# Altium schematic sheet 1_P1.schdoc
size 429 x 307 mm; Symbol: Drawing-Symbol_A4; Device: Drawing-Symbol_A4; Company: 嘉立创EDA; Drawed: Ideal_Fox; Version: V3.0; Page Size: A3; @Project Name: Type_C硬盘盒_2025-09-27_14-32-02; @Page Count: 1; @Update Date: 2025-12-05; @Create Date: 2025-09-27; @Schematic Name: Schematic1; @Page No: 1; @Page Name: P1; @Create Time: 06:32:47; @Update Time: 22:13:30; Width: 1655; Height: 1170; Region Start: 1; X Region Count: 6; Y Region Count: 4; Blade Width: 10; Title Block Position: 3; @Board Name: Board1
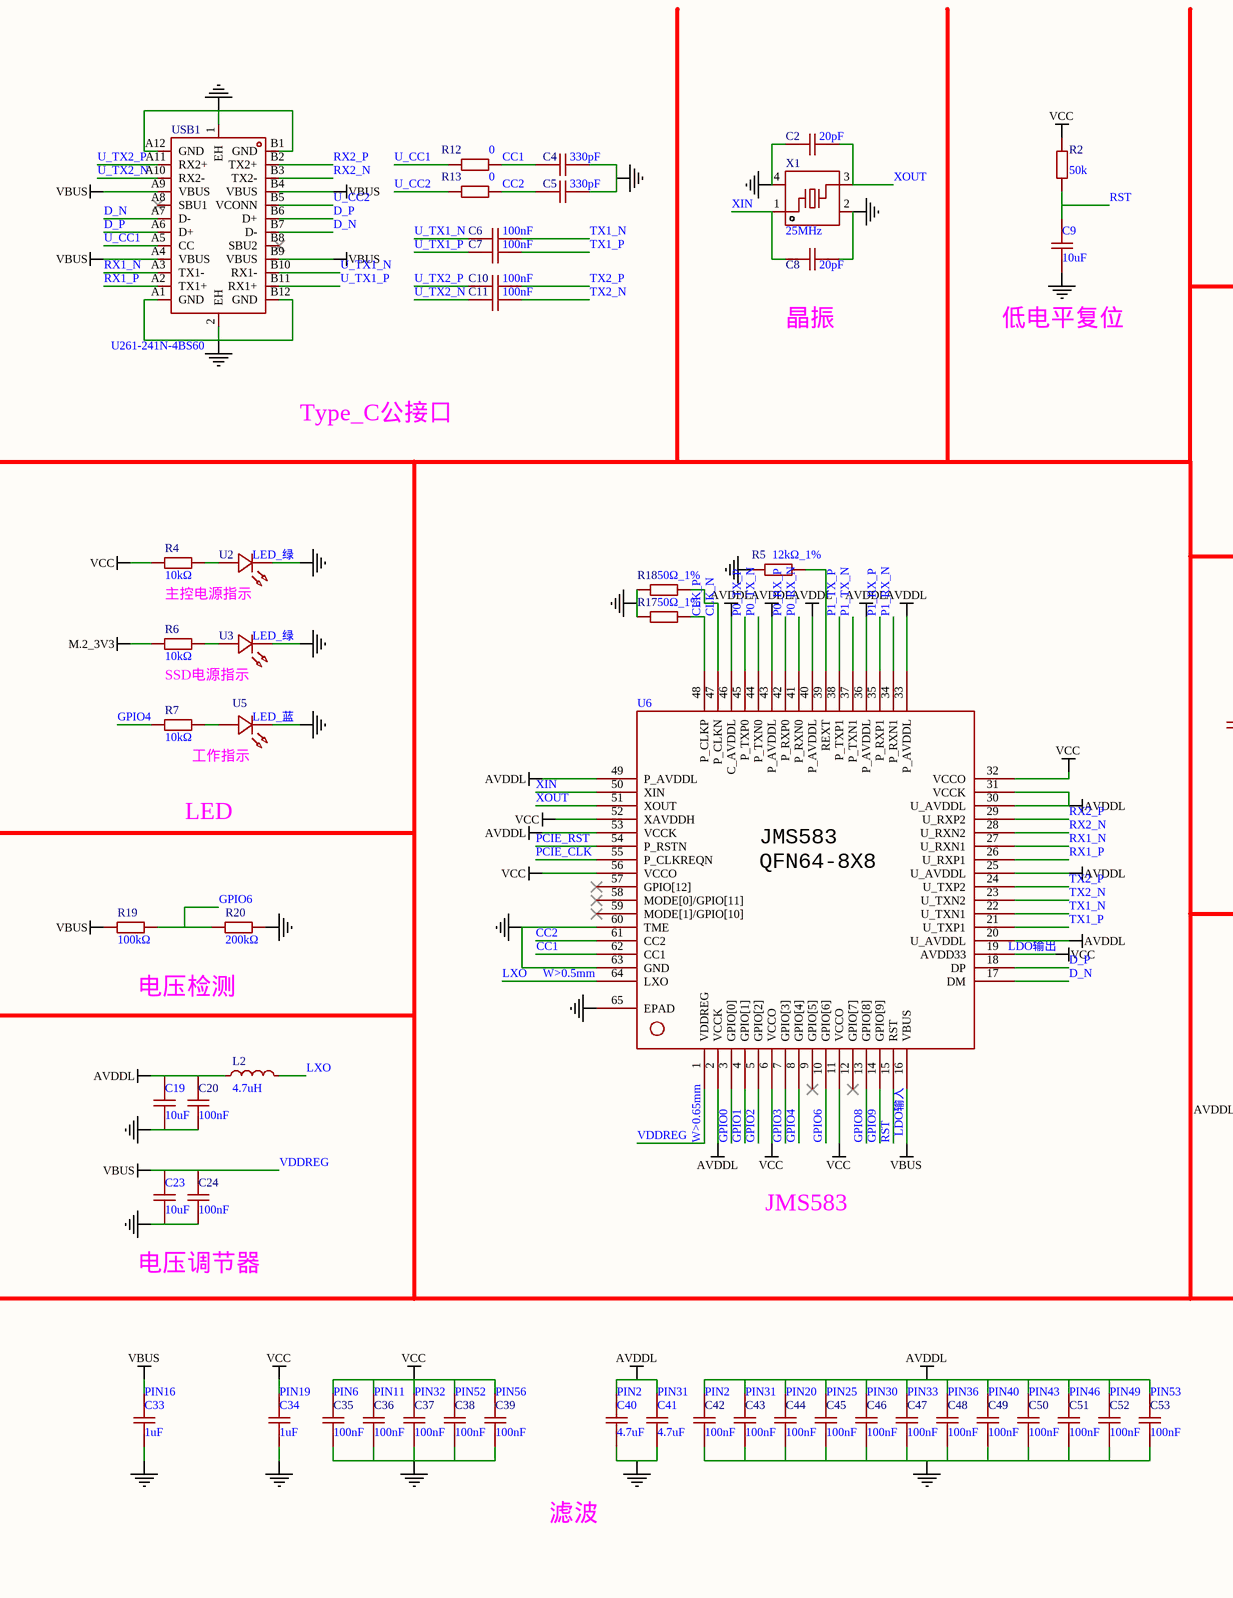
[diagram p0: 1_P1.schdoc, left]
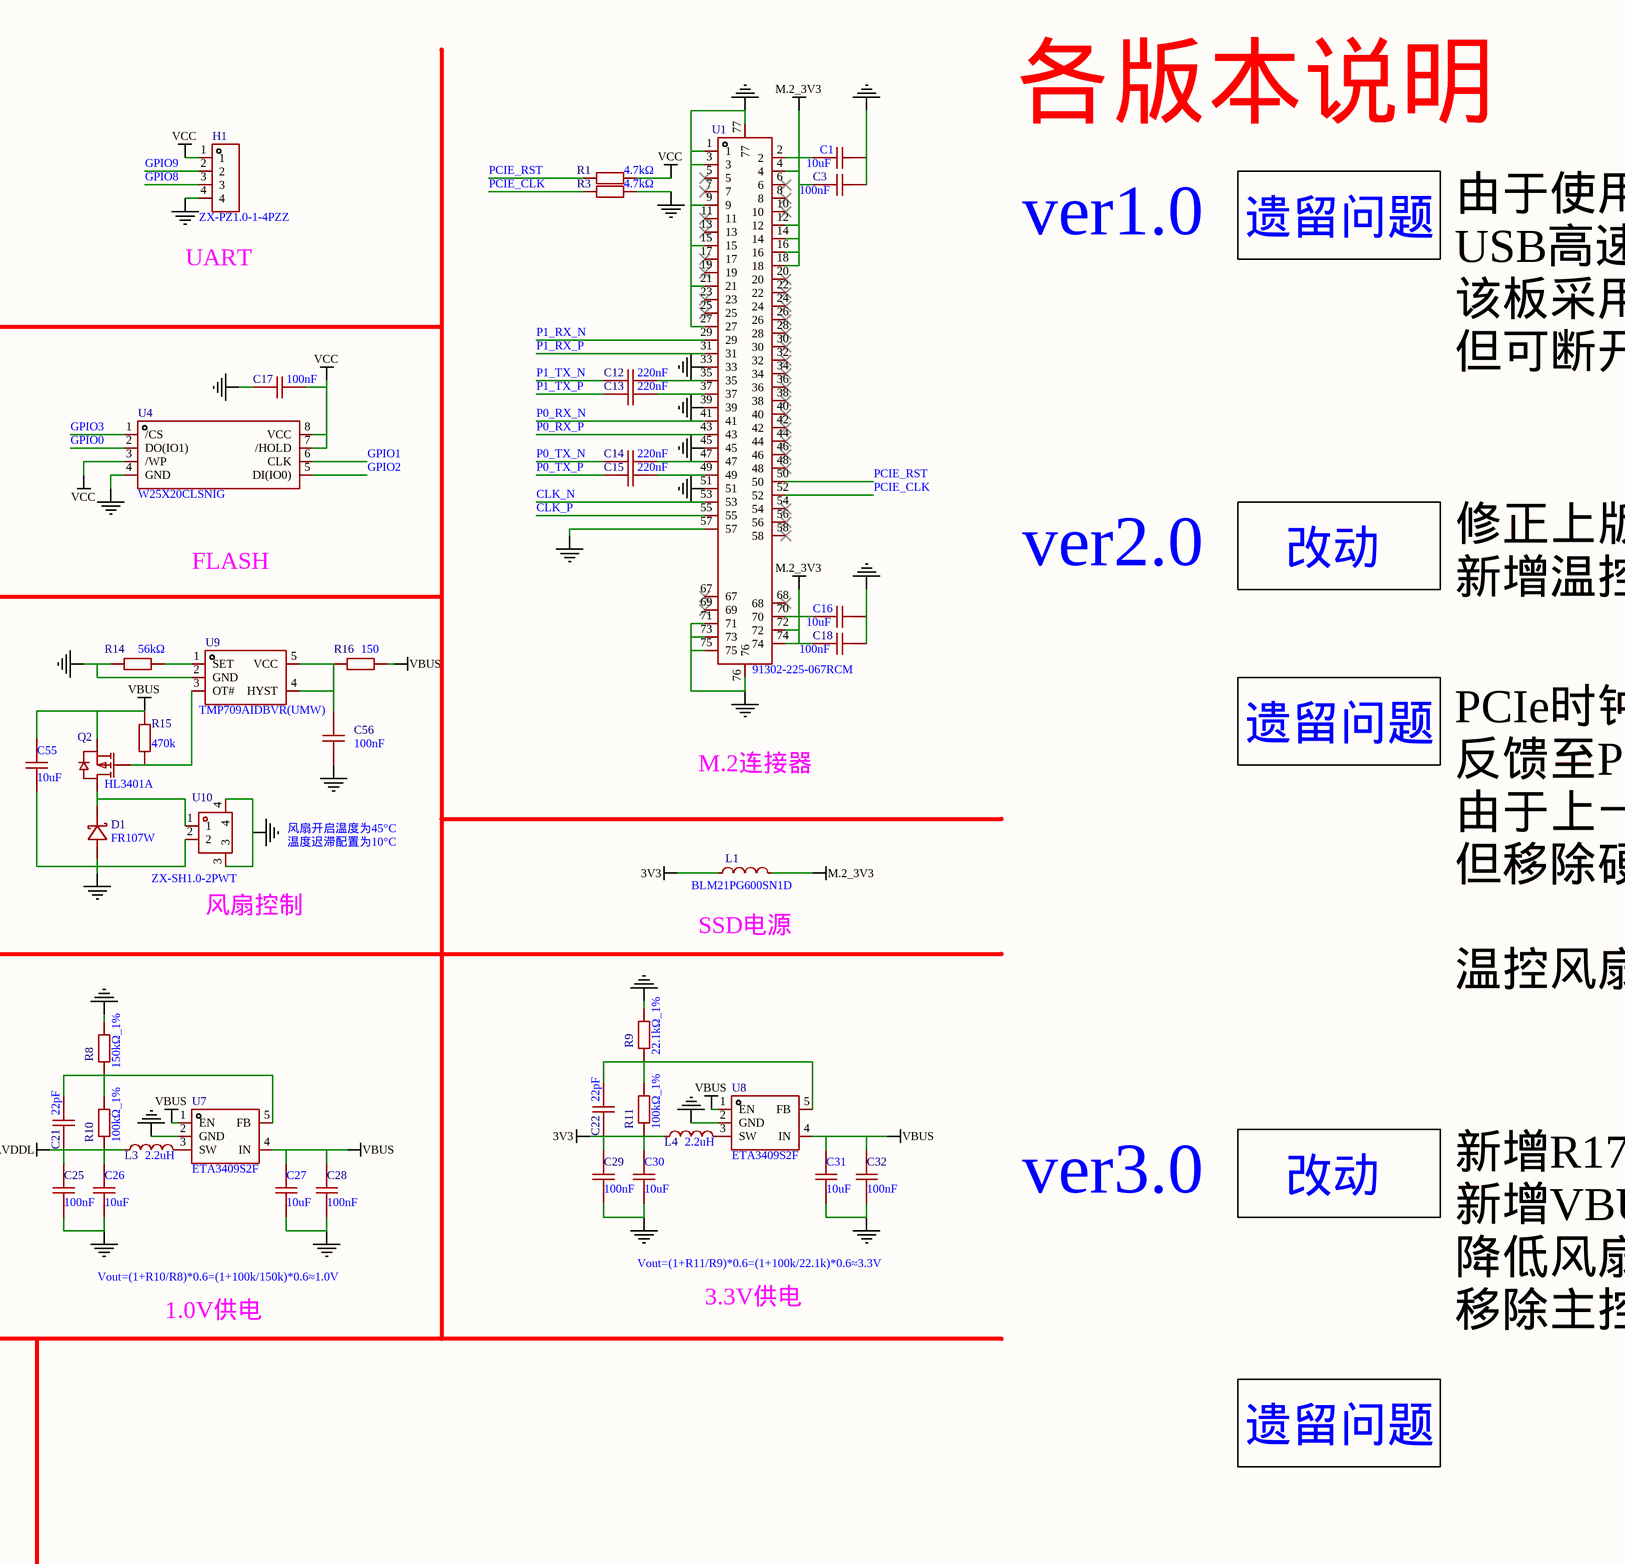
[diagram p1: 1_P1.schdoc, right]

## Parts
C1  10uF  [C0603]
C2  20pF  [C0402]
C3  100nF  [C0402]
C4  330pF  [C0402]
C5  330pF  [C0402]
C6  100nF  [C0402]
C7  100nF  [C0402]
C8  20pF  [C0402]
C9  10uF  [C0603]
C10  100nF  [C0402]
C11  100nF  [C0402]
C12  220nF  [C0402]
C13  220nF  [C0402]
C14  220nF  [C0402]
C15  220nF  [C0402]
C16  10uF  [C0603]
C17  100nF  [C0402]
C18  100nF  [C0402]
C19  10uF  [C0603]
C20  100nF  [C0402]
C21  22pF  [C0402]
C22  22pF  [C0402]
C23  10uF  [C0603]
C24  100nF  [C0402]
C25  100nF  [C0402]
C26  10uF  [C0603]
C27  10uF  [C0603]
C28  100nF  [C0402]
C29  100nF  [C0402]
C30  10uF  [C0603]
C31  10uF  [C0603]
C32  100nF  [C0402]
C33  1uF  [C0603]
C34  1uF  [C0603]
C35  100nF  [C0402]
C36  100nF  [C0402]
C37  100nF  [C0402]
C38  100nF  [C0402]
C39  100nF  [C0402]
C40  4.7uF  [C0603]
C41  4.7uF  [C0603]
C42  100nF  [C0402]
C43  100nF  [C0402]
C44  100nF  [C0402]
C45  100nF  [C0402]
C46  100nF  [C0402]
C47  100nF  [C0402]
C48  100nF  [C0402]
C49  100nF  [C0402]
C50  100nF  [C0402]
C51  100nF  [C0402]
C52  100nF  [C0402]
C53  100nF  [C0402]
C55  10uF  [C0603]
C56  100nF  [C0402]
D1  FR107W  [SOD-123FL_L2.7-W1.8-LS3.8-RD]
H1  ZX-PZ1.0-1-4PZZ  [HDR-TH_ZX-PZ1.0-1-4PZZ]
L1  BLM21PG600SN1D  [L0805]
L2  4.7uH  [IND-SMD_L2.5-W2.0-VLS252012CX-150M]
L3  2.2uH  [IND-SMD_L2.5-W2.0_MHCHL2520]
L4  2.2uH  [IND-SMD_L2.5-W2.0_MHCHL2520]
Q2  HL3401A  [SOT-23-3_L2.9-W1.3-P1.90-LS2.4-BR]
R1  4.7kΩ  [R0402]
R2  50k  [R0402]
R3  4.7kΩ  [R0402]
R4  10kΩ  [R0402]
R5  12kΩ_1%  [R0402]
R6  10kΩ  [R0402]
R7  10kΩ  [R0402]
R8  150kΩ_1%  [R0402]
R9  22.1kΩ_1%  [R0402]
R10  100kΩ_1%  [R0402]
R11  100kΩ_1%  [R0402]
R12  0  [R0402]
R13  0  [R0402]
R14  56kΩ  [R0402]
R15  470k  [R0402]
R16  150  [R0402]
R17  50Ω_1%  [R0402]
R18  50Ω_1%  [R0402]
R19  100kΩ  [R0402]
R20  200kΩ  [R0402]
U1  91302-225-067RCM  [CONN-SMD_91302-225-067RCM]
U2  LED_绿  [LED0603-RD_GREEN]
U3  LED_绿  [LED0603-RD_GREEN]
U4  W25X20CLSNIG  [SOIC-8_L5.0-W4.0-P1.27-LS6.0-BL]
U5  LED_蓝  [LED0603-R-RD]
U6  JMS583  [QFN-64_L8.0-W8.0-P0.40-TL-EP6.0]  (value not drawn)
U7  ETA3409S2F  [SOT-23-5_L2.9-W1.6-P0.95-LS2.8-BL]
U8  ETA3409S2F  [SOT-23-5_L2.9-W1.6-P0.95-LS2.8-BL]
U9  TMP709AIDBVR(UMW)  [SOT-23-5_L3.0-W1.5-P0.95-LS2.8-BL]
U10  ZX-SH1.0-2PWT  [CONN-SMD_2P-P1.00_HX-1.0-2P-WT]
USB1  U261-241N-4BS60  [USB-TYPE-C-SMD_U261-241N-4BS60]
X1  25MHz  [CRYSTAL-SMD_4P-L3.2-W2.5-BL]

## Nets
3V3: C22.1 C29.2 C30.2 L1.1 L4.1 R11.2
AVDDL: C19.2 C20.2 C21.1 C25.2 C26.2 C40.2 C41.2 C42.2 C43.2 C44.2 C45.2 C46.2 C47.2 C48.2 C49.2 C50.2 C51.2 C52.2 C53.2 L2.1 L3.1 R10.2 U6.2(VCCK) U6.20(U_AVDDL) U6.25(U_AVDDL) U6.30(U_AVDDL) U6.31(VCCK) U6.33(P_AVDDL) U6.36(P_AVDDL) U6.40(P_AVDDL) U6.43(P_AVDDL) U6.46(C_AVDDL) U6.49(P_AVDDL) U6.53(VCCK)
GND: C1.2 C2.1 C3.1 C4.2 C5.2 C8.1 C9.1 C16.2 C17.1 C18.1 C19.1 C20.1 C23.1 C24.1 C25.1 C26.1 C27.1 C28.1 C29.1 C30.1 C31.1 C32.1 C33.1 C34.1 C35.1 C36.1 C37.1 C38.1 C39.1 C40.1 C41.1 C42.1 C43.1 C44.1 C45.1 C46.1 C47.1 C48.1 C49.1 C50.1 C51.1 C52.1 C53.1 C55.1 C56.2 D1.2(A) H1.4 R3.2 R5.2 R8.1 R9.1 R14.1 R17.2 R18.2 R20.2 U1.1 U1.3 U1.9 U1.15 U1.21 U1.27 U1.33 U1.39 U1.45 U1.51 U1.57 U1.71 U1.73 U1.75 U1.76 U1.77 U2.1(K) U3.1(K) U4.4(GND) U5.2(K) U6.60(TME) U6.63(GND) U6.65(EPAD) U7.2(GND) U8.2(GND) U9.2(GND) U10.2 U10.3 U10.4 USB1.1(EH) USB1.2(EH) USB1.A1(GND) USB1.A12(GND) USB1.B1(GND) USB1.B12(GND) X1.2(GND) X1.4(GND)
M.2_3V3: C1.1 C3.2 C16.1 C18.2 L1.2 R6.1 U1.2 U1.4 U1.12 U1.14 U1.16 U1.18 U1.70 U1.72 U1.74
VCC: C17.2 C34.2 C35.2 C36.2 C37.2 C38.2 C39.2 H1.1 R1.2 R2.1 R4.1 U4.3(/WP) U4.7(/HOLD) U4.8(VCC) U6.6(VCCO) U6.11(VCCO) U6.19(AVDD33) U6.32(VCCO) U6.52(XAVDDH) U6.56(VCCO)
VDDREG: C23.2 C24.2 C27.2 C28.2 C31.2 C32.2 C33.2 C55.2 Q2.2(S) R15.1 R16.1 R19.1 U6.1(VDDREG) U6.16(VBUS) U7.1(EN) U7.4(IN) U8.1(EN) U8.4(IN) USB1.A4(VBUS) USB1.A9(VBUS) USB1.B4(VBUS) USB1.B9(VBUS)  [also labelled VBUS]
CC1: C4.1 R12.2 U6.62(CC1)
CC2: C5.1 R13.2 U6.61(CC2)
CLK_N: R18.1 U1.53 U6.47(P_CLKN)
CLK_P: R17.1 U1.55 U6.48(P_CLKP)
D_N: U6.17(DM) USB1.A7(D-) USB1.B7(D-)
D_P: U6.18(DP) USB1.A6(D+) USB1.B6(D+)
GPIO0: U4.2(DO(IO1)) U6.3(GPIO[0])
GPIO1: U4.6(CLK) U6.4(GPIO[1])
GPIO2: U4.5(DI(IO0)) U6.5(GPIO[2])
GPIO3: U4.1(/CS) U6.7(GPIO[3])
GPIO4: R7.1 U6.8(GPIO[4])
GPIO6: R19.2 R20.1 U6.10(GPIO[6])
GPIO8: H1.3 U6.13(GPIO[8])
GPIO9: H1.2 U6.14(GPIO[9])
LXO: L2.2 U6.64(LXO)
P0_RX_N: U1.41 U6.41(P_RXN0)
P0_RX_P: U1.43 U6.42(P_RXP0)
P0_TX_N: C14.1 U6.44(P_TXN0)
P0_TX_P: C15.1 U6.45(P_TXP0)
P1_RX_N: U1.29 U6.34(P_RXN1)
P1_RX_P: U1.31 U6.35(P_RXP1)
P1_TX_N: C12.1 U6.37(P_TXN1)
P1_TX_P: C13.1 U6.38(P_TXP1)
PCIE_CLK: R3.1 U1.52 U6.55(P_CLKREQN)
PCIE_RST: R1.1 U1.50 U6.54(P_RSTN)
RST: C9.2 R2.2 U6.15(RST)
RX1_N: U6.27(U_RXN1) USB1.A3(TX1-)
RX1_P: U6.26(U_RXP1) USB1.A2(TX1+)
RX2_N: U6.28(U_RXN2) USB1.B3(TX2-)
RX2_P: U6.29(U_RXP2) USB1.B2(TX2+)
TX1_N: C6.2 U6.22(U_TXN1)
TX1_P: C7.2 U6.21(U_TXP1)
TX2_N: C11.2 U6.23(U_TXN2)
TX2_P: C10.2 U6.24(U_TXP2)
U_CC1: R12.1 USB1.A5(CC)
U_CC2: R13.1 USB1.B5(VCONN)
U_TX1_N: C6.1 USB1.B10(RX1-)
U_TX1_P: C7.1 USB1.B11(RX1+)
U_TX2_N: C11.1 USB1.A10(RX2-)
U_TX2_P: C10.1 USB1.A11(RX2+)
XIN: C8.2 U6.50(XIN) X1.1
XOUT: C2.2 U6.51(XOUT) X1.3
NetC12_2: C12.2 U1.35
NetC13_2: C13.2 U1.37
NetC14_2: C14.2 U1.47
NetC15_2: C15.2 U1.49
NetC21_2: C21.2 R8.2 R10.1 U7.5(FB)
NetC22_2: C22.2 R9.2 R11.1 U8.5(FB)
NetC56_1: C56.1 R16.2 U9.4(HYST) U9.5(VCC)
NetD1_1: D1.1(K) Q2.3(D) U10.1
NetL3_2: L3.2 U7.3(SW)
NetL4_2: L4.2 U8.3(SW)
NetQ2_1: Q2.1(G) R15.2 U9.3(OT#)
NetR4_2: R4.2 U2.2(A)
NetR5_1: R5.1 U6.39(REXT)
NetR6_2: R6.2 U3.2(A)
NetR7_2: R7.2 U5.1(A)
NetR14_2: R14.2 U9.1(SET)

Not connected (* = marked no-connect by the designer): U1 5* 6* 7* 8* 10* 11* 13* 17* 19* 20* 22* 23* 24* 25* 26* 28* 30* 32* 34* 36* 38* 40* 42* 44* 46* 48* 54* 56* 58* 67* 68* 69*; U6 9(GPIO[5])* 12(GPIO[7])* 57(GPIO[12])* 58(MODE[0]/GPIO[11])* 59(MODE[1]/GPIO[10])*; USB1 A8(SBU1)* B8(SBU2)*

## Notes on the sheet
- 各版本说明
- 由于使用Type_C公制接口，
  USB高速通讯线RX与TX应在该处进行交叉相连，
  该板采用直接连接方式，导致协议握手错误，PC端无法识别该设备
  但可断开USB高速线路，降级使用USB2.0传输协议
- ver1.0
- 遗留问题
- (near H1) UART
- (near C8) 晶振
- (near C9) 低电平复位
- Type_C公接口
- 修正上版错误，
  新增温控风扇用于散热
- FLASH
- ver2.0
- 改动
- 主控电源指示
- SSD电源指示
- PCIe时钟线CLKN与CLKP缺少R17,R18偏置电阻，导致主控PCIe链路训练失败，
  反馈至PC端的现象是，无法获取USB设备地址
  由于上一版所连接的SSD硬盘时钟线上自带偏置电阻，能通过链路训练，故并未发觉此问题，
  但移除硬盘或改用其他无偏置电阻的硬盘时则会出现此问题
  温控风扇的启动温度设定过高，导致硬盘和主控变得很烫时风扇才开始工作
- M.2连接器
- LED
- 工作指示
- 风扇开启温度为45°C
  温度迟滞配置为10°C
- (near U10) 风扇控制
- (near U6) LDO输出
- (near L1) SSD电源
- 电压检测
- (near U6) W>0.5mm
- 新增R17,R18偏置电阻
  新增VBUS电压采集电阻R19,R20
  降低风扇启动温度至45度
  移除主控自带的1V电压调节电路，主控1V电压端只使用外部DCDC供电
- (near U6) W>0.65mm
- LDO输入
- JMS583
- Vout=(1+R11/R9)*0.6=(1+100k/22.1k)*0.6≈3.3V
- ver3.0
- 电压调节器
- Vout=(1+R10/R8)*0.6=(1+100k/150k)*0.6≈1.0V
- 1.0V供电
- 3.3V供电
- (near C33) PIN16
- (near C34) PIN19
- (near C35) PIN6
- PIN11
- PIN32
- PIN52
- (near C39) PIN56
- (near C40) PIN2
- (near C41) PIN31
- (near C42) PIN2
- PIN31
- PIN20
- PIN25
- PIN30
- PIN33
- PIN36
- PIN40
- PIN43
- PIN46
- PIN49
- (near C53) PIN53
- 滤波
- 1
- 2
- 3
- 4
- 5
- 6
- A
- B
- C
- 原理图
- Schematic1
- 创建日期
- 更新日期
- 2025-09-27
- 2025-12-05
- D
- 板子
- 绘制
- Ideal_Fox
- Board1
- 图页
- P1
- 审阅
- 版本
- 尺寸
- Type_C硬盘盒_2025-09-27_14-32-02
- 页    1    共    1
- V3.0
- A3
- 嘉立创EDA
- (in symbol JMS583) JMS583 / QFN64-8X8

## Library data of the parts
C1 C9 C16 C19 C23 C26 C27 C30 C31 C33 C34 C40 C41 C55 = CAP_0603: Symbol: Capacitance; Convert to PCB: yes; Device: CAP_0603; Add into BOM: yes; Supplier Footprint: 0603
  C1 C9 C16 C19 C23 C26 C27 C30 C31 C55: Value: 10uF
  C33 C34: Value: 1uF
  C40 C41: Value: 4.7uF
C2-C8 C10-C15 C17 C18 C20-C22 C24 C25 C28 C29 C32 C35-C39 C42-C53 C56 = CL05B104KB54PNC: Manufacturer: SAMSUNG(三星); Add into BOM: yes; Tolerance: ±10%; Voltage Rating: 50V; Temperature Coefficient: X7R; Symbol: CL05B104KB54PNC; Device: CL05B104KB54PNC; LCSC Part Name: 100nF ±10% 50V; Manufacturer Part: CL05B104KB54PNC; Supplier Footprint: 0402; JLCPCB Part Class: 基础库; Datasheet: https://item.szlcsc.com/datasheet/CL05B104KB54PNC/291005.html; Supplier: LCSC; Convert to PCB: yes
  C2 C8: Value: 20pF
  C3 C6 C7 C10 C11 C17 C18 C20 C24 C25 C28 C29 C32 C35-C39 C42-C53 C56: Value: 100nF
  C4 C5: Value: 330pF
  C12-C15: Value: 220nF
  C21 C22: Value: 22pF
D1 = FR107W_C18199114: Manufacturer: R+O(宏嘉诚); Add into BOM: yes; Diode Configuration: 独立式; Voltage - Forward(Vf@If): 1.3V@1.0A; Voltage - DC Reverse(Vr): 1kV; Current - Rectified: 1A; Reverse Leakage Current (Ir): 2uA@1000V; Reverse Recovery Time (trr): 500ns; Operating Junction Temperature Range: -55℃~+150℃; Non-Repetitive Peak Forward Surge Current: 30A; Symbol: FR107W_C18199114; Device: FR107W_C18199114; LCSC Part Name: 耐压:1000V 电流:1A 反向恢复时间：500ns; Supplier Part: C18199114; Manufacturer Part: FR107W; Supplier Footprint: SOD-123FL; JLCPCB Part Class: 扩展库; Datasheet: https://item.szlcsc.com/datasheet/FR107W/19354346.html; Supplier: LCSC; Convert to PCB: yes
H1 = ZX-PZ1.0-1-4PZZ: Manufacturer: Megastar(兆星); Add into BOM: yes; Pin Structure: 1x4P; Pitch: 1mm; Circluar Pins/Square Pins: 方针; Current Rating: 750mA; Symbol: ZX-PZ1.0-1-4PZZ; Device: ZX-PZ1.0-1-4PZZ; LCSC Part Name: 1x4P 间距:1mm 方针 直插; Supplier Part: C37328854; Manufacturer Part: ZX-PZ1.0-1-4PZZ; Supplier Footprint: 插件,P=1mm; JLCPCB Part Class: 扩展库; Datasheet: https://item.szlcsc.com/datasheet/ZX-PZ1.0-1-4PZZ/39053335.html; Supplier: LCSC; Convert to PCB: yes; Row Spacing: -; Mounting Type: 直插; Number of Rows: 单排; Number of Pins: 4P; Voltage Rating (Max): -; Length of Mating Pin: 2mm; Insulation Height: 1mm; Length of End Connection Pin: 2mm; Contact Material: 黄铜; Contact Plating: 金; Operating Temperature: -40℃~+105℃; Color: 黑色
L1 = BLM21PG600SN1D: Manufacturer: muRata(村田); Add into BOM: yes; Impedance @ Frequency: 60Ω@100MHz; Tolerance: ±25%; DC Resistance(DCR): 20mΩ; Current Rating: 3.5A; Number of Circuits: 1; Symbol: BLM21PG600SN1D; Device: BLM21PG600SN1D; LCSC Part Name: 单路 0805磁珠 阻抗60Ω@100MHz; Supplier Part: C18305; Manufacturer Part: BLM21PG600SN1D; Supplier Footprint: 0805; JLCPCB Part Class: 扩展库; Datasheet: https://item.szlcsc.com/datasheet/BLM21PG600SN1D/19000.html; Supplier: LCSC; Convert to PCB: yes
L2 = FTC252010S4R7MBCA: Manufacturer: cjiang(长江微电); Add into BOM: yes; Tolerance: ±20%; Current Rating: 2A; Current - Saturation(Isat): 2.6A; DC Resistance(DCR): 160mΩ; Symbol: FTC252010S4R7MBCA; Device: FTC252010S4R7MBCA; LCSC Part Name: 4.7uH ±20% 2.6A; Supplier Part: C5832360; Manufacturer Part: FTC252010S4R7MBCA; Supplier Footprint: 1008; JLCPCB Part Class: 扩展库; Datasheet: https://item.szlcsc.com/datasheet/FTC252010S4R7MBCA/6763480.html; Supplier: LCSC; Convert to PCB: yes; Value: 4.7uH; Type: -
L3 L4 = FTC252012S2R2MBCA: Manufacturer: cjiang(长江微电); Add into BOM: yes; Tolerance: ±20%; Rated Current: 3A; Saturation Current (Isat): 3.8A; DC Resistance (DCR): 55mΩ; Type: 一体成型电感; Symbol: FTC252012S2R2MBCA; Device: FTC252012S2R2MBCA; LCSC Part Name: 2.2uH ±20% 3.8A; Supplier Part: C5832372; Manufacturer Part: FTC252012S2R2MBCA; Supplier Footprint: 1008; JLCPCB Part Class: 扩展库; Datasheet: https://atta.szlcsc.com/upload/public/pdf/source/20230602/8FFEDA9C0247A92A0D4B67554BFE4091.pdf; Supplier: LCSC; Convert to PCB: yes; Value: 2.2uH
Q2 = HL3401A: Manufacturer: R+O(宏嘉诚); Add into BOM: yes; Number: 1个P沟道; Drain to Source Voltage: 30V; Current - Continuous Drain(Id): 4.2A; RDS(on): 50mΩ@10V; Pd - Power Dissipation: 350mW; Gate Threshold Voltage (Vgs(th)): 900mV@250uA; Gate Charge(Qg): 22nC@10V; Input Capacitance(Ciss): 954pF; Reverse Transfer Capacitance (Crss@Vds): 77pF; Type: P沟道; Output Capacitance(Coss): 115pF; Symbol: HL3401A; Device: HL3401A; LCSC Part Name: 1个P沟道 耐压:30V 电流:4.2A; Supplier Part: C7420349; Manufacturer Part: HL3401A; Supplier Footprint: SOT-23; JLCPCB Part Class: 扩展库; Datasheet: https://item.szlcsc.com/datasheet/HL3401A/8397171.html; Supplier: LCSC; Convert to PCB: yes; Operating Temperature: -55℃~+150℃
R1-R13 R15-R20 = 0402WGF1002TCE: Manufacturer: UNI-ROYAL(厚声); Add into BOM: yes; Tolerance: ±1%; Power(Watts): 62.5mW; Voltage-Supply(Max): 50V; Temperature Coefficient: ±100ppm/℃; Symbol: 0402WGF1002TCE; Device: 0402WGF1002TCE; LCSC Part Name: 10kΩ ±1% 62.5mW 厚膜电阻; Manufacturer Part: 0402WGF1002TCE; Supplier Footprint: 0402; JLCPCB Part Class: 基础库; Datasheet: https://item.szlcsc.com/datasheet/0402WGF1002TCE/26487.html; Supplier: LCSC; Convert to PCB: yes; Type: 厚膜电阻; Operating Temperature: -55℃~+155℃
  R1 R3: Value: 4.7kΩ
  R2: Value: 50k
  R4 R6 R7: Supplier Part: C25744; Value: 10kΩ
  R5: Value: 12kΩ_1%
  R8: Value: 150kΩ_1%
  R9: Value: 22.1kΩ_1%
  R10 R11: Value: 100kΩ_1%
  R12 R13: Value: 0
  R15: Value: 470k
  R16: Value: 150
  R17 R18: Value: 50Ω_1%
  R19: Value: 100kΩ
  R20: Value: 200kΩ
R14 = 0402WGF4702TCE: Manufacturer: UNI-ROYAL(厚声); Add into BOM: yes; Tolerance: ±1%; Power(Watts): 62.5mW; Voltage-Supply(Max): 50V; Temperature Coefficient: ±100ppm/℃; Symbol: 0402WGF4702TCE; Device: 0402WGF4702TCE; LCSC Part Name: 47kΩ ±1% 62.5mW 厚膜电阻; Manufacturer Part: 0402WGF4702TCE; Supplier Footprint: 0402; JLCPCB Part Class: 基础库; Datasheet: https://item.szlcsc.com/datasheet/0402WGF4702TCE/26535.html; Supplier: LCSC; Convert to PCB: yes; Type: 厚膜电阻; Value: 56kΩ; Operating Temperature: -55℃~+155℃
U1 = 91302-225-067RCM: Manufacturer: UMaxconn(友贸); Add into BOM: yes; Interface Form: M.2-M Key; Connector Type: 母; Supplementary Features: 带柱; Symbol: 91302-225-067RCM; Device: 91302-225-067RCM; LCSC Part Name: 91302-225-067RCM; Supplier Part: C42387244; Manufacturer Part: 91302-225-067RCM; Supplier Footprint: SMD; JLCPCB Part Class: 扩展库; Datasheet: https://atta.szlcsc.com/upload/public/pdf/source/20241115/E5280E40E542625C5F46F982007C9B56.pdf; Supplier: LCSC; Convert to PCB: yes; Number of Pins: 67P; Mounting Type: 卧贴; Height Above Board: 2.25mm; Operating Temperature: -
U2 U3 = XL-1608PGC-06: Manufacturer: XINGLIGHT(成兴光); Add into BOM: yes; Illumination Color: 翠绿色; Voltage - Forward(Vf): 2.6V~3V; Wavelength - Dominant: 515nm~530nm; Peak Wavelength: 525nm; Lens Color: 绿色透镜; Luminous Intensity: 900mcd; Viewing Angle: 120°; Symbol: XL-1608PGC-06; Device: XL-1608PGC-06; LCSC Part Name: 0603加粉翠绿0.6T贴片式发光二极管; Supplier Part: C7371905; Manufacturer Part: LED_绿; Supplier Footprint: 0603; JLCPCB Part Class: 扩展库; Datasheet: https://item.szlcsc.com/datasheet/XL-1608PGC-06/8342977.html; Supplier: LCSC; Convert to PCB: yes; Lamp Holder Type: -; Power(Watts): -; Forward Current: -; Diode Configuration: -; Color Temperature: -; Mounting Style: 正贴; Operating Temperature: -
U4 = W25X20CLSNIG: Manufacturer: Winbond(华邦); Symbol: W25X20CLSNIG_C409019; Add into BOM: yes; Interface: SPI; Memory Size: 2Mbit; Clock Frequency: 104MHz; Voltage - Supply: 2.3V~3.6V; Standby Supply Current: 1uA; Program / Erase Cycles: 100000次; Page Programming Time (Tpp): 400us; Block Erase Time(tBE): 120ms@(32KB); Data Retention - TDR (Year): 20年; Device: W25X20CLSNIG; LCSC Part Name: 具有4KB扇区和双IO SPI接口的2Mbit 串行SPI闪存; Supplier Part: C409019; Manufacturer Part: W25X20CLSNIG; Supplier Footprint: SOIC-8; JLCPCB Part Class: 扩展库; Datasheet: https://item.szlcsc.com/datasheet/W25X20CLSNIG/398848.html; Supplier: LCSC; Convert to PCB: yes; Operating Temperature: -40℃~+85℃
U5 = XL-1608UBC-06A: Manufacturer: XINGLIGHT(成兴光); Add into BOM: yes; Illumination Color: 蓝色; Voltage - Forward(Vf): 2.6V~3V; Forward Current: 5mA; Wavelength - Dominant: 456nm~476nm; Lens Color: 无色透明透镜; Viewing Angle: 130°; Mounting Sytle: 正贴; Symbol: XL-1608UBC-06A; Device: XL-1608UBC-06A; LCSC Part Name: XL-1608UBC-06A; Supplier Part: C7371904; Manufacturer Part: LED_蓝; Supplier Footprint: 0603; JLCPCB Part Class: 扩展库; Datasheet: https://item.szlcsc.com/datasheet/XL-1608UBC-06A/8342976.html; Supplier: LCSC; Convert to PCB: yes; Lamp Holder Type: -; Power(Watts): -; Peak Wavelength: -; Diode Configuration: -; Color Temperature: -; Luminous Intensity: -; Operating Temperature: -
U6 = JMS583: Add into BOM: yes; PCB Footprint: QFN64-8X8-1; Symbol: JMS583; Device: JMS583; Convert to PCB: yes
U7 U8 = ETA3409S2F: Manufacturer: ETA(钰泰); Add into BOM: yes; Function: 降压型; Output Type: 可调; Voltage - Supply: 2.4V~7.3V; Output Current: 3A; Frequency - Switching: 1MHz; Number of Outputs: 1; Topology: 降压式; Switch tube (built-in/external): 内置; Symbol: ETA3409S2F; Device: ETA3409S2F; LCSC Part Name: 3A 1MHz 同步降压转换器; Supplier Part: C7465553; Manufacturer Part: ETA3409S2F; Supplier Footprint: SOT23-5; JLCPCB Part Class: 扩展库; Datasheet: https://atta.szlcsc.com/upload/public/pdf/source/20230717/1A18EB96698AD4DC30E5926DF3CDB8A4.pdf; Supplier: LCSC; Convert to PCB: yes; Operating Temperature: -40℃~+85℃; Synchronous Rectifier: -; Quiescent Current: -
U9 = TMP709AIDBVR(UMW): Manufacturer: UMW(友台半导体); Add into BOM: yes; Symbol: TMP709AIDBVR(UMW); Device: TMP709AIDBVR(UMW); LCSC Part Name: 温度开关; Supplier Part: C22396387; Manufacturer Part: TMP709AIDBVR(UMW); Supplier Footprint: SOT-23-5; JLCPCB Part Class: 扩展库; Datasheet: https://item.szlcsc.com/datasheet/TMP709AIDBVR(UMW)/24000858.html; Supplier: LCSC; Convert to PCB: yes
U10 = ZX-SH1.0-2PWT: Manufacturer: Megastar(兆星); Add into BOM: yes; Pins Structure: 1x2P; Pitch: 1mm; Reference Series: SH; Number of PINs Per Row: 2; Current Rating: 1A; Voltage Rating: 50V; Plastic Material: LCP; Supplementary Features: 辅助焊脚; Z-Height of the Board: 3.15mm; X-Length of Bottom Edge on Board (Spacing Line): 4.35mm; Y-Width of Bottom Edge on Board: 4.3mm; Symbol: ZX-SH1.0-2PWT; Device: ZX-SH1.0-2PWT; LCSC Part Name: 1x2P 间距:1mm 卧贴 系列:SH; Supplier Part: C7430444; Manufacturer Part: ZX-SH1.0-2PWT; Supplier Footprint: SMD,P=1mm,卧贴; JLCPCB Part Class: 扩展库; Datasheet: https://item.szlcsc.com/datasheet/ZX-SH1.0-2PWT/8430313.html; Supplier: LCSC; Convert to PCB: yes; Mounting Type: 卧贴; Number of Pins: 2P; Number of Rows: 1; Row Spacing: -; Contact Material: 黄铜; Contact Plating: 锡; Operating Temperature: -40℃~+85℃; Flame Retardant Rating: -; Color: 米色
USB1 = U261-241N-4BS60: Manufacturer: XKB Connection(中国星坤); Add into BOM: yes; Connector Type: Type-C; Gender: 公; Number of Contacts: 24P; Number of Ports: 1; Current Rating - Power (Max): 5A; Soldering Temperature(Max): 260℃; Symbol: U261-241N-4BS60; Device: U261-241N-4BS60; LCSC Part Name: Type-C 公; Supplier Part: C319150; Manufacturer Part: U261-241N-4BS60; Supplier Footprint: SMD; JLCPCB Part Class: 扩展库; Datasheet: https://atta.szlcsc.com/upload/public/pdf/source/20200227/C319150_AD2CD3943CA114D7AAA081193314EFA4.pdf; Supplier: LCSC; Convert to PCB: yes; Standard: -; Mounting Style: -; Contact Material: 高导铜; Contact Plating: 金; Operating Temperature Range: -40℃~+85℃
X1 = XL2EL89CSI-111YLC-25M: Manufacturer: YXC(扬兴晶振); Add into BOM: yes; Normal temperature Frequency Tolerance: ±10ppm; Load Capacitance: 20pF; Frequency Stability: ±20ppm; Symbol: XL2EL89CSI-111YLC-25M; Device: XL2EL89CSI-111YLC-25M; LCSC Part Name: YSX321SL 25MHZ 4P 3225 20PF ±10PPM -40~85℃ (±20PPM); Supplier Part: C5280577; Manufacturer Part: XL2EL89CSI-111YLC-25M; Supplier Footprint: SMD3225-4P; JLCPCB Part Class: 扩展库; Datasheet: https://item.szlcsc.com/datasheet/XL2EL89CSI-111YLC-25M/6016759.html; Supplier: LCSC; Convert to PCB: yes; Type: 贴片晶振; Value: 25MHz; Operating Temperature: -40℃~+85℃